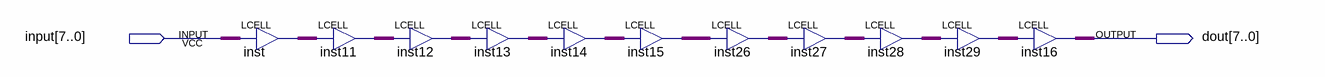
[diagram p0: schematic sheet]
// Quartus schematic delay_8bits.bdf as structural Verilog: 11 symbols, 2 pins
module delay_8bits (
  input  [7:0] \input ,
  output [7:0] dout
);

  wire [7:0] inst11_out, inst12_out, inst13_out, inst14_out, inst15_out, inst26_out, inst27_out, inst28_out,
       inst29_out, inst_out;

  LCELL inst[7:0] (.IN(\input ), .OUT(inst_out));
  LCELL inst11[7:0] (.IN(inst_out), .OUT(inst11_out));
  LCELL inst12[7:0] (.IN(inst11_out), .OUT(inst12_out));
  LCELL inst13[7:0] (.IN(inst12_out), .OUT(inst13_out));
  LCELL inst14[7:0] (.IN(inst13_out), .OUT(inst14_out));
  LCELL inst15[7:0] (.IN(inst14_out), .OUT(inst15_out));
  LCELL inst26[7:0] (.IN(inst15_out), .OUT(inst26_out));
  LCELL inst27[7:0] (.IN(inst26_out), .OUT(inst27_out));
  LCELL inst28[7:0] (.IN(inst27_out), .OUT(inst28_out));
  LCELL inst29[7:0] (.IN(inst28_out), .OUT(inst29_out));
  LCELL inst16[7:0] (.IN(inst29_out), .OUT(dout));
endmodule
